# EAGLE design Hiking Log Rev A (EAGLE 9.4.2)
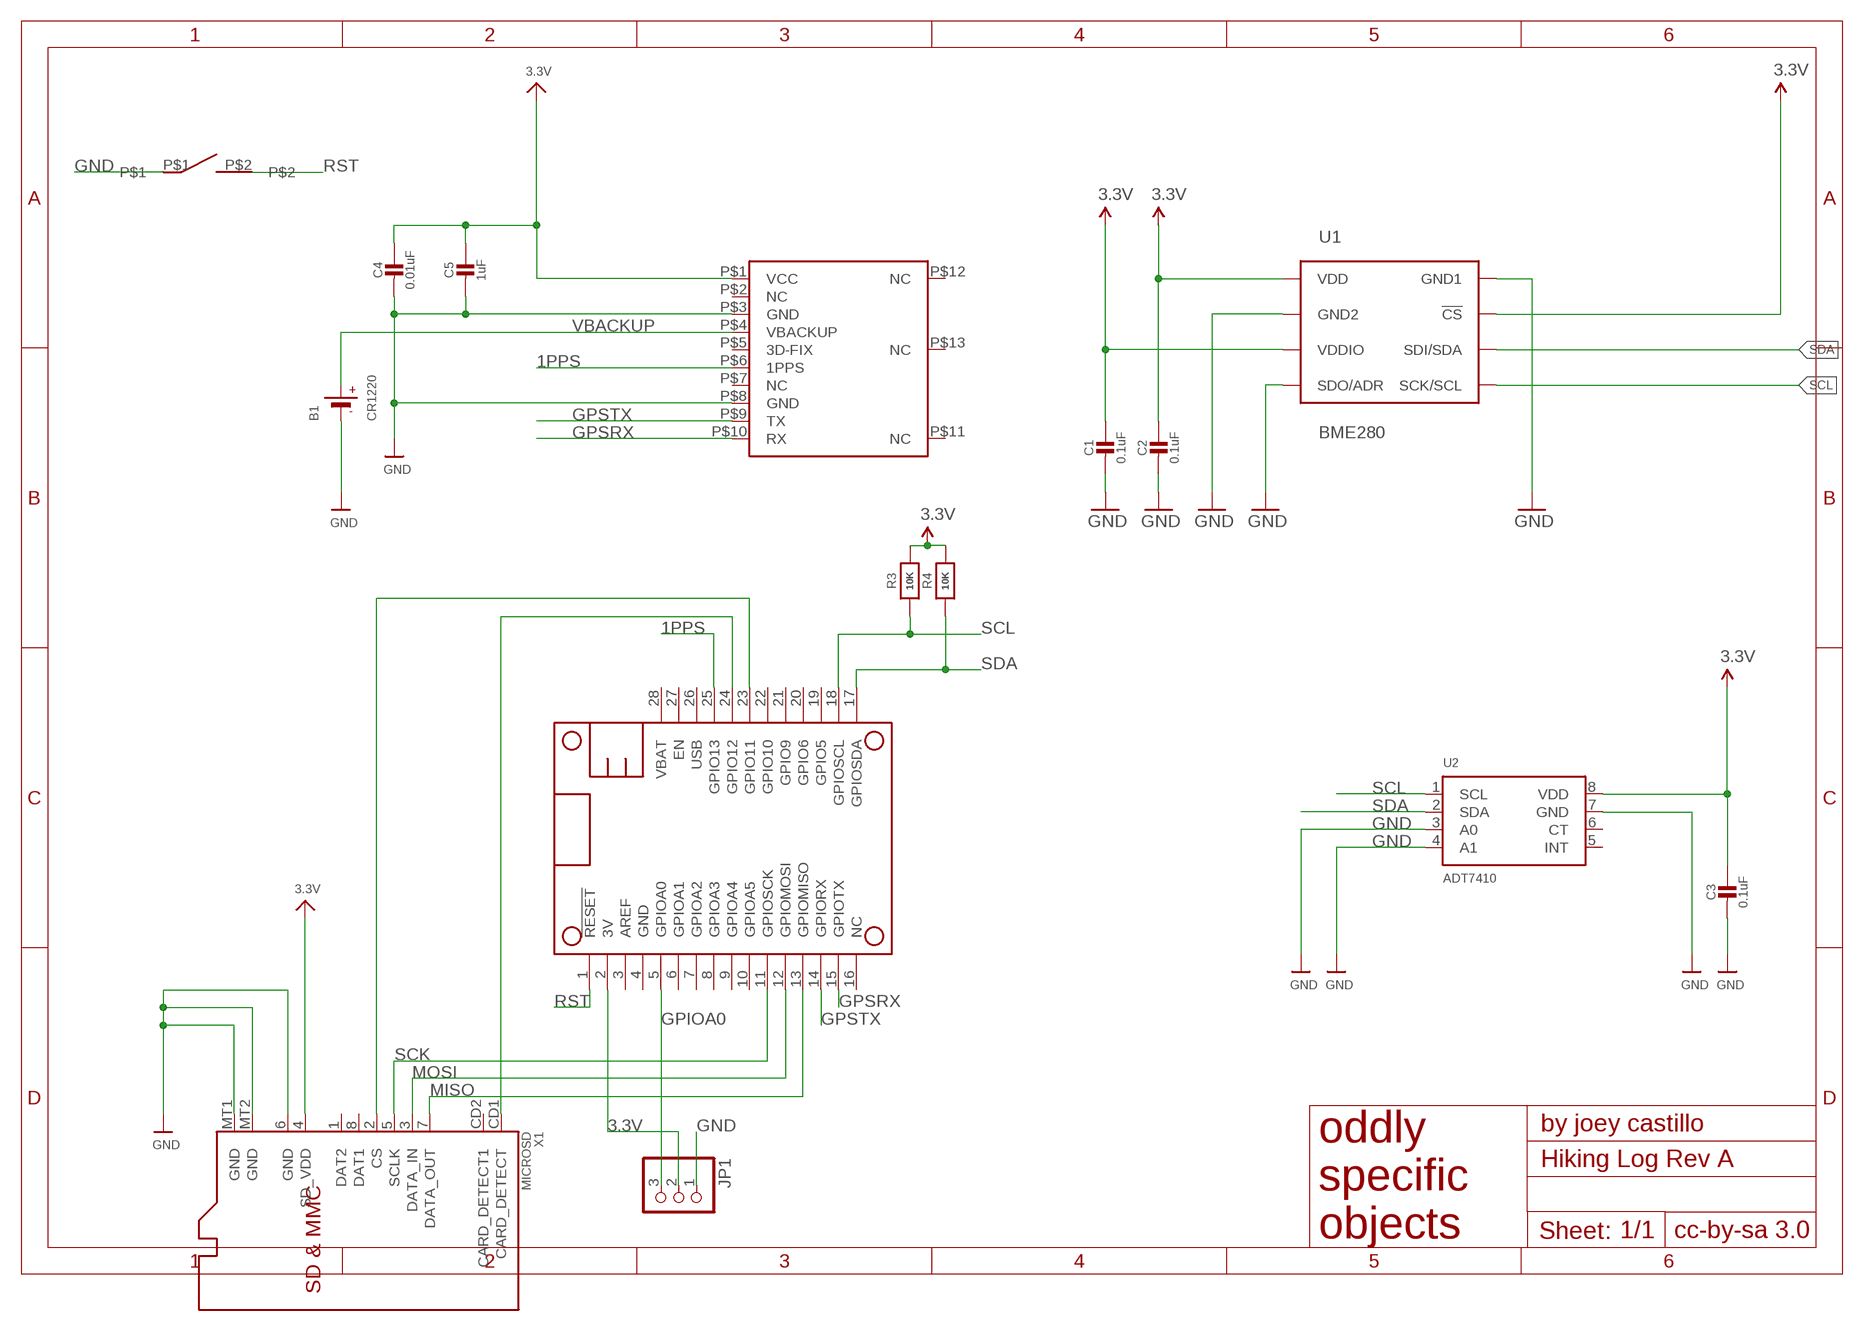
[diagram p0: schematic, sheet 1]

## Parts
B1  CR1220  BATTERYCR1220_2  [CR1220-2]
C1  0.1uF  CAP_CERAMIC_0805MP  [_0805MP]
C2  0.1uF  CAP_CERAMIC_0805MP  [_0805MP]
C3  0.1uF  CAP_CERAMIC_0805MP  [_0805MP]
C4  0.01uF  CAP_CERAMIC_0805MP  [_0805MP]
C5  1uF  CAP_CERAMIC_0805MP  [_0805MP]
JP1  PINHD-1X3CB  [1X03-CLEANBIG]
MS1  FEATHERWING  [FEATHERWING]
R3  10K  RESISTOR_0805MP  [_0805MP]
R4  10K  RESISTOR_0805MP  [_0805MP]
S1  MINISOFTTOUCHBUTTON  [MINISOFTTOUCHBUTTON]
U1  BME280  [BME280_LGA]
U2  ADT7410  TEMP_ADT7410  [SOIC8_150MIL]
U3  GPS_FGPMMOPA6C  [FGPMMOPA6C]
X1  MICROSD  [MICROSD]

## Nets
1PPS: MS1.25(GPIO13) U3.P$6(1PPS)
3.3V: C1.1 C2.1 C3.1 C4.1 C5.1 JP1.2 MS1.2(3V) R3.2 R4.2 U1.P$2(!CS) U1.P$6(VDDIO) U1.P$8(VDD) U2.8(VDD) U3.P$1(VCC) X1.4(SD_VDD)
CD: MS1.24(GPIO12) X1.CD1(CARD_DETECT)
GND: B1.- C1.2 C2.2 C3.2 C4.2 C5.2 JP1.1 S1.P$1 U1.P$1(GND1) U1.P$5(SDO/ADR) U1.P$7(GND2) U2.3(A0) U2.4(A1) U2.7(GND) U3.P$3(GND) U3.P$8(GND) X1.6(GND) X1.MT1(GND) X1.MT2(GND)
GPIOA0: JP1.3 MS1.5(GPIOA0)
GPSRX: MS1.15(GPIOTX) U3.P$10(RX)
GPSTX: MS1.14(GPIORX) U3.P$9(TX)
MISO: MS1.13(GPIOMISO) X1.7(DATA_OUT)
MOSI: MS1.12(GPIOMOSI) X1.3(DATA_IN)
RST: MS1.1(!RESET) S1.P$2
SCK: MS1.11(GPIOSCK) X1.5(SCLK)
SCL: MS1.18(GPIOSCL) R3.1 U1.P$4(SCK/SCL) U2.1(SCL)
SDA: MS1.17(GPIOSDA) R4.1 U1.P$3(SDI/SDA) U2.2(SDA)
SDCS: MS1.23(GPIO11) X1.2(CS)
VBACKUP: B1.+ U3.P$4(VBACKUP)
Unconnected: MS1.3(AREF) MS1.6(GPIOA1) MS1.7(GPIOA2) MS1.8(GPIOA3) MS1.9(GPIOA4) MS1.10(GPIOA5) MS1.16(NC) MS1.19(GPIO5) MS1.20(GPIO6) MS1.21(GPIO9) MS1.22(GPIO10) MS1.26(USB) MS1.27(EN) MS1.28(VBAT) U2.5(INT) U2.6(CT) U3.P$2(NC) U3.P$5(3D-FIX) U3.P$7(NC) U3.P$11(NC) U3.P$12(NC) U3.P$13(NC) X1.1(DAT2) X1.8(DAT1) X1.CD2(CARD_DETECT1)

## Power pins joined to a net without a drawn wire
GND: MS1.4(GND)

## Library data of the parts
B1 = microbuilder:BATTERY: CR1220 SMT - Digikey: 3001K-ND CD2032 BAT-HLD-001 - Digikey: BAT-HLD-001-ND
C1-C5 = microbuilder:CAP_CERAMIC: Ceramic Capacitors For new designs, use the packages preceded by an '_' character since they are more reliable: The following footprints should be used on most boards: _0402 - Standard footprint for regular board layouts _0603 - Standard footprint for regular board layouts _0805 - Standard footprint for regular board layouts _1206 - Standard footprint for regular board layouts For extremely tight-pitch boards where space is at a premium, the following 'micro-pitch' footprints can be used (smaller pads, no silkscreen outline, etc.): _0402MP - Micro-pitch footprint for very dense/compact boards _0603MP - Micro-pitch footprint for very dense/compact boards _0805MP - Micro-pitch footprint for very dense/compact boards _1206MP - Micro-pitch footprint for very dense/compact boards
JP1 = adafruit:PINHD-1X3: PIN HEADER
MS1 = microbuilder:FEATHERWING
R3 R4 = microbuilder:RESISTOR: Resistors For new designs, use the packages preceded by an '_' character since they are more reliable: The following footprints should be used on most boards: _0402 - Standard footprint for regular board layouts _0603 - Standard footprint for regular board layouts _0805 - Standard footprint for regular board layouts _1206 - Standard footprint for regular board layouts For extremely tight-pitch boards where space is at a premium, the following 'micro-pitch' footprints can be used (smaller pads, no silkscreen outline, etc.): _0402MP - Micro-pitch footprint for very dense/compact boards _0603MP - Micro-pitch footprint for very dense/compact boards _0805MP - Micro-pitch footprint for very dense/compact boards _1206MP - Micro-pitch footprint for very dense/compact boards
S1 = My Stuff:MINISOFTTOUCHBUTTON
U1 = BME280ComponentLibrary:BME280; PROD_ID: IC-13090
U2 = microbuilder:TEMP_ADT7410: ADT7410 - 13-bit 0.5°C I2C Temperature Sensor Operating Voltage: 2.7-5.5V Temperature Range: -55°C-150°C Accuracy: 0.5°C from -40°C-105°C Shutdown Current: 2uA (3.3V) Typical Operating Current (1 Sample/s): 46uA (3.3V) Digikey: ADT7410TRZ-ND
U3 = adafruit:GPS_FGPMMOPA6C: FGPMMOPA6C 16x16 GPS Module NMEA Sentences: GGA, GSA, GSV, RMC, VTG
X1 = microbuilder:MICROSD: MicroSD/Transflash Card Holder with SPI pinout 3M: 2908-05WB-MG 4UConnector: 19656 Footprint courtesy: Adafruit Industries

## Board
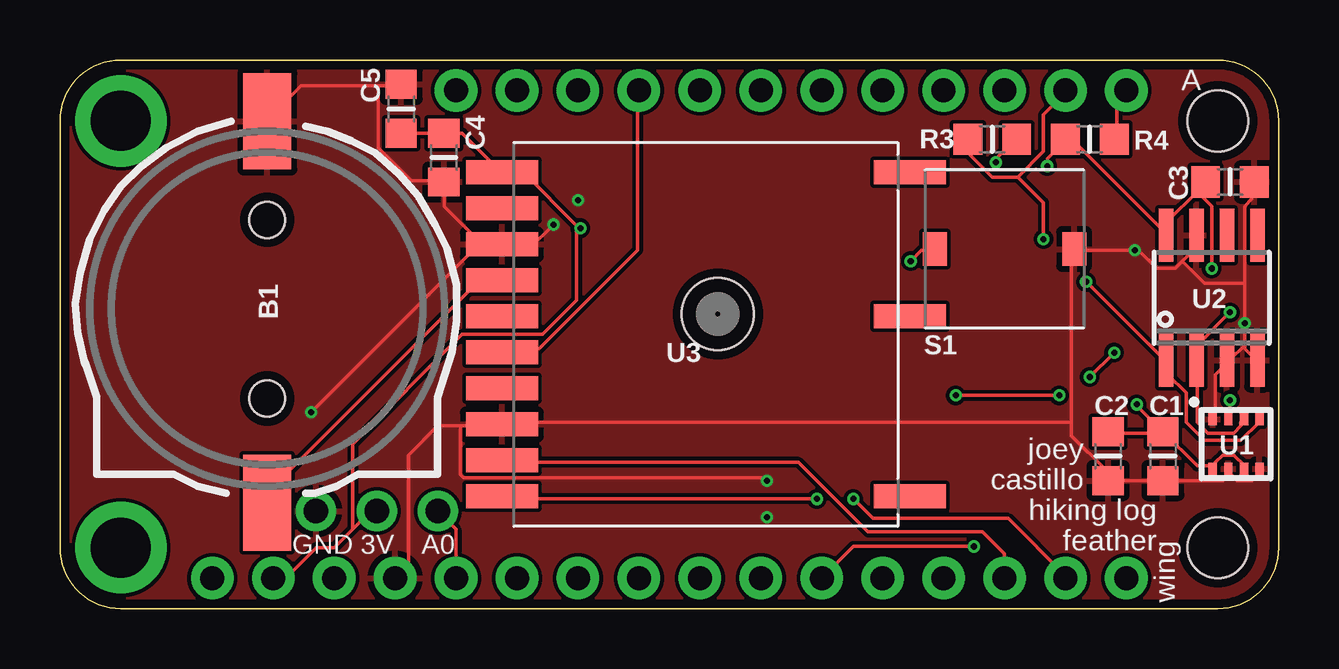
[diagram p1: board, top side]
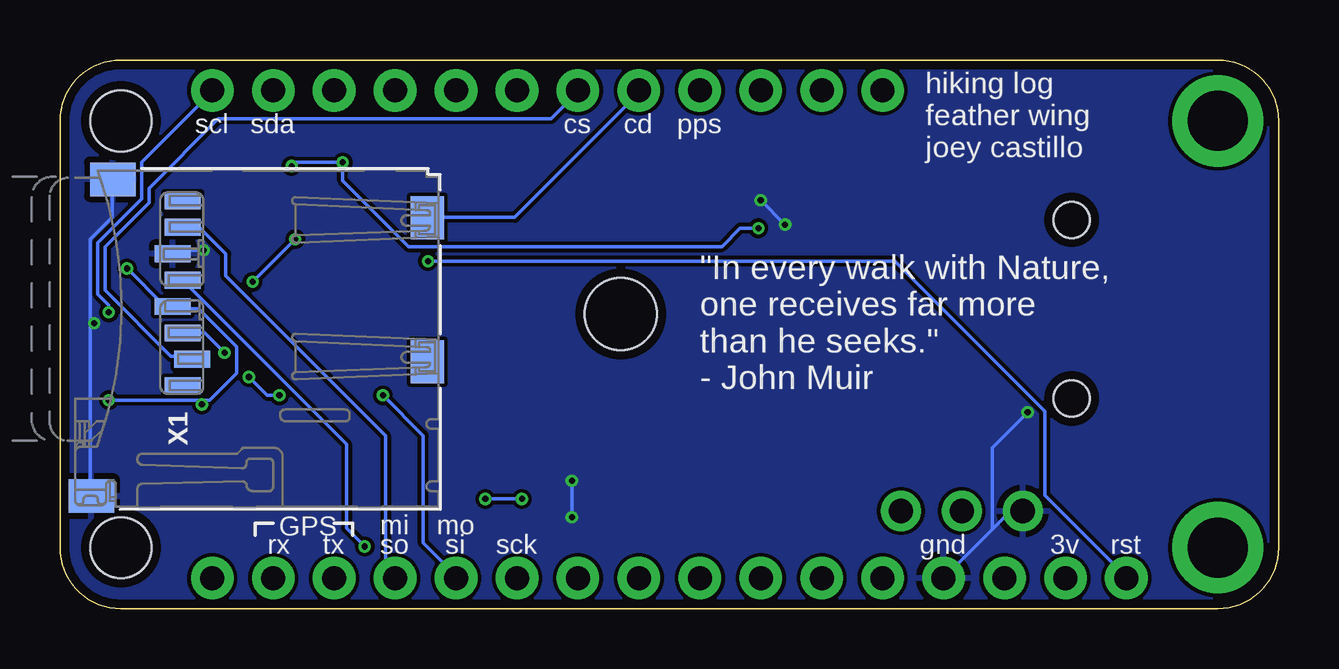
[diagram p2: board, bottom side, seen from below]

Size 50.8 x 22.86 mm. Coordinates in mm from the lower left corner, seen from the top.
Outline: 2.54,22.86 48.26,22.86 arc-90 50.8,20.32 50.8,2.54 arc-90 48.26,0 2.54,0 arc-90 0,2.54 0,20.32 arc-90 2.54,22.86
Copper layers (1*16): Top 0.035559375mm / dielectric 1.6mm / Bottom 0.035559375mm
Design rules "oshpark-2layer": minimum track width 6mil, minimum drill 10mil, track to track 6mil, track to pad 6mil, pad to pad 6mil, via to via 6mil, smd to smd 6mil, copper to edge 15mil, drill to drill 6mil, minimum pad ring 5mil, minimum via ring 5mil, stop-mask expansion 2.5mil, vias tented up to drill 0mil, thermal gap 10mil

### Footprints (pad centres in the part's own frame; a part is rotated, then mirrored left to right if it is on the bottom)
CR1220-2 = smd 4 x 2: + 8.29,0; - -7.6,0 | hole 1.5: 3.95,0; -3.5,0
_0805MP = smd 1.2 x 1.3: 1 -1.016,0; 2 1.016,0
1X03-CLEANBIG = drill 1.016 pad 1.676: 1 -2.54,0; 2 0,0; 3 2.54,0
FEATHERWING = drill 1 pad 1.778: 1 6.35,1.27; 2 8.89,1.27; 3 11.43,1.27; 4 13.97,1.27; 5 16.51,1.27; 6 19.05,1.27; 7 21.59,1.27; 8 24.13,1.27; 9 26.67,1.27; 10 29.21,1.27; 11 31.75,1.27; 12 34.29,1.27; 13 36.83,1.27; 14 39.37,1.27; 15 41.91,1.27; 16 44.45,1.27; 17 44.45,21.59; 18 41.91,21.59; 19 39.37,21.59; 20 36.83,21.59; 21 34.29,21.59; 22 31.75,21.59; 23 29.21,21.59; 24 26.67,21.59; 25 24.13,21.59; 26 21.59,21.59; 27 19.05,21.59; 28 16.51,21.59 | drill 2.5 pad 3.81: P$1 2.54,20.32; P$2 2.54,2.54 | hole 2.54: 48.26,20.32; 48.26,2.54
MINISOFTTOUCHBUTTON = smd 1 x 1.4: P$1 0.4,-3.3; P$2 6.2,-3.3
BME280_LGA = smd 0.5 x 0.35: P$1 1.025,0.975; P$2 1.025,0.325; P$3 1.025,-0.325; P$4 1.025,-0.975; P$5 -1.025,-0.975; P$6 -1.025,-0.325; P$7 -1.025,0.325; P$8 -1.025,0.975
SOIC8_150MIL = smd 0.6 x 2.2: 1 -1.905,-2.6; 2 -0.635,-2.6; 3 0.635,-2.6; 4 1.905,-2.6; 5 1.905,2.6; 6 0.635,2.6; 7 -0.635,2.6; 8 -1.905,2.6
FGPMMOPA6C = smd 3 x 1: P$1 -8.5,6.75; P$2 -8.5,5.25; P$3 -8.5,3.75; P$4 -8.5,2.25; P$5 -8.5,0.75; P$6 -8.5,-0.75; P$7 -8.5,-2.25; P$8 -8.5,-3.75; P$9 -8.5,-5.25; P$10 -8.5,-6.75; P$11 8.5,-6.75; P$12 8.5,0.75; P$13 8.5,6.75 | hole 3: 0.5,0.85
MICROSD = smd 0.7 x 1.5: 1 9,-10.64; 2 7.9,-10.24; 3 6.8,-10.64; 4 5.7,-11.04; 5 4.6,-10.64; 6 3.5,-11.04; 7 2.4,-10.64; 8 1.3,-10.64 | smd 1.8 x 1.4: CD1 2,-0.44; CD2 8,-0.44 | smd 1.4 x 1.9: MT1 0.4,-13.54; MT2 13.6,-14.44

### Placement (x,y rotation side)
B1  8.64,12.7 270 top
C1  45.97,6.35 270 top
C2  43.69,6.35 270 top
C3  48.77,17.78 0 top
C4  16,18.8 270 top
C5  14.22,20.83 90 top
JP1  13.21,4.06 0 top
MS1  0,0 0 top
R3  38.86,19.56 0 top
R4  42.93,19.56 180 top
S1  42.67,11.68 180 top
U1  49.02,6.86 90 top
U2  48.01,12.95 0 top
U3  26.92,11.43 0 top
X1  35.05,18.29 270 bottom

### Tracks (layer width: path | path; a pad name or v marks a point on that pad's centre or on a via)
1PPS
  Top 0.152: U3.P$6 18.44,10.82 19.96,10.82 24.08,14.94 24.08,21.49 MS1.25
3.3V  (via drill 0.25)
  Top 0.152: U1.P$6 49.38,5.94 48.92,6.4 48.46,6.4 48.16,6.1 48.16,5.94 U1.P$8 48.01,5.94 47.4,5.94 C1.1 | C2.1 43.74,7.32 45.87,7.32 C1.1 | v48.77,8.69 48.77,7.92 U1.P$2 | v44.88,8.51 44.88,8.46 C1.1 | v39.01,18.59 39.01,18.75 39.78,19.51 R3.2 | v41.15,18.44 41.15,18.75 41.91,19.51 | 47.4,17.37 46.18,16.15 46.18,15.7 U2.8 46.02,15.7 42.22,19.51 41.91,19.51 | 47.4,17.37 47.7,17.68 C3.1 47.4,17.37 | 41.91,19.51 R4.2 | v48.01,14.17 48.01,16.76 47.4,17.37 | C5.1 C4.1 16.76,19.81 18.29,18.29 U3.P$1 18.44,18.14 19.36,18.14 21.54,15.95 21.54,15.85 | 12.19,3.3 12.19,6.86 16.76,11.43 20.12,11.43 21.54,12.85 21.54,15.85 | 12.19,3.3 11.43,2.54 10.67,2.54 9.4,1.27 MS1.2 | 21.54,15.85 v21.69,15.85 | 12.19,3.3 12.95,4.06 JP1.2
  Bottom 0.152: 44.88,8.69 44.55,8.69 43.43,9.8 43.43,10.92 45.01,12.5 46.02,12.5 X1.4 46.18,12.65 46.48,12.65 v48.01,14.17 | 44.88,8.69 v48.77,8.69 | 44.88,8.69 v44.88,8.51 | v41.15,18.44 41,18.59 v39.01,18.59 39.01,17.83 36.27,15.09 23.22,15.09 22.45,15.85 v21.69,15.85
CD
  Bottom 0.152: X1.CD1 35.36,16.31 31.85,16.31 26.67,21.49 MS1.24
GND  (via drill 0.25)
  Top 0.152: 17.53,15.24 16,16.76 C4.2 16,17.83 14.63,17.83 13.26,19.2 13.26,21.79 | 17.53,15.24 18.29,15.24 U3.P$3 | 13.26,21.79 10.06,21.79 8.69,20.42 B1.- | 13.26,21.79 14.17,21.79 C5.2 | 16.76,7.62 15.75,7.62 14.53,6.4 14.53,1.83 MS1.4 | 16.76,7.62 18.29,7.62 U3.P$8 18.44,7.77 42.16,7.77 | U1.P$1 48.16,7.92 48.16,9.75 48.62,10.21 U2.3 48.77,10.36 49.38,10.97 | 49.38,10.97 49.38,10.82 49.84,10.36 U2.4 | 49.38,10.97 v49.38,11.89 49.38,13.56 | 49.38,13.56 49.38,16.76 49.68,17.07 49.68,17.68 C3.2 | 48.77,5.64 48.77,5.79 U1.P$7 48.77,5.64 | 48.77,5.64 49.07,5.33 49.68,5.33 50.14,5.79 U1.P$5 | 48.77,5.64 48.46,5.33 C1.2 C2.2 43.59,5.33 43.59,5.79 42.16,7.21 42.16,7.77 | 42.67,14.94 v44.81,14.94 44.96,14.94 45.72,14.17 46.48,14.17 46.79,14.48 | 42.37,14.94 42.16,14.94 42.16,7.77 | 42.67,14.94 42.37,14.94 | 46.79,14.48 47.24,14.94 47.24,15.54 U2.7 | 42.37,14.94 S1.P$1 42.67,14.94 | 49.38,13.56 47.7,13.56 46.79,14.48 | 17.53,15.24 v10.46,8.18 | 17.53,15.24 U3.P$3 | U3.P$3 19.36,15.18 19.56,14.99 v20.57,16 | v29.46,5.33 29.35,5.45 16.83,5.45 16.7,5.58 16.7,7.55 16.76,7.62 | 16.76,7.62
  Bottom 0.152: 49.53,11.89 49.53,4.72 X1.MT2 | 49.53,11.89 49.53,15.39 48.62,16.31 48.62,17.83 X1.MT1 | v44.81,14.94 46.02,14.94 X1.6 | v49.38,11.89 49.53,11.89 | MS1.4 11.94,3.3 | v10.46,8.18 11.94,6.71 11.94,3.3 | 11.94,3.3 11.18,4.06 JP1.1 | v21.59,17.02 v20.57,16 | v29.46,5.33 v29.46,3.81
  pour Top: 49.78,23.11 50.8,22.1 51.31,21.59 51.31,1.27 49.78,-0.25 48.01,-0.25 1.52,-0.25 -0.51,1.78 -0.51,21.84 0.76,23.11 1.02,23.11
  pour Bottom: 49.78,23.11 50.8,22.1 51.31,21.59 51.31,1.27 49.78,-0.25 48.01,-0.25 1.52,-0.25 -0.51,1.78 -0.51,21.59 1.02,23.11
GPIOA0
  Top 0.152: JP1.3 16.51,3.3 MS1.5
GPSRX  (via drill 0.25)
  Top 0.152: v31.55,4.57 18.44,4.57 U3.P$10 | v33.07,4.57 33.88,3.76 39.52,3.76 41.91,1.37 MS1.15
  Bottom 0.152: v33.07,4.57 v31.55,4.57
GPSTX
  Top 0.152: U3.P$9 18.44,6.1 30.79,6.1 33.68,3.2 38.46,3.2 39.37,2.29 MS1.14
MISO
  Bottom 0.152: MS1.13 37.24,1.68 37.24,7.21 43.89,13.87 43.89,14.78 44.96,15.85 45.57,15.85 X1.7
MOSI  (via drill 0.25)
  Top 0.152: v37.34,8.89 v41.66,8.89 | v43.94,10.67 v42.93,9.65
  Bottom 0.152: MS1.12 34.29,1.37 35.66,2.74 35.66,7.21 v37.34,8.89 | X1.3 44.76,11.49 v43.94,10.67 | v42.93,9.65 42.16,8.89 v41.66,8.89
RST  (via drill 0.25)
  Top 0.152: v35.46,14.48 35.92,14.94 36.42,14.94 S1.P$2
  Bottom 0.152: v35.46,14.48 16,14.48 9.75,8.23 9.75,4.72 6.4,1.37 MS1.1
SCK  (via drill 0.25)
  Top 0.152: v38.1,2.59 33.07,2.59 MS1.11
  Bottom 0.152: X1.5 38.86,6.86 38.86,3.35 v38.1,2.59
SCL  (via drill 0.25)
  Top 0.152: U1.P$4 49.99,7.77 49.23,7.01 47.7,7.01 46.94,7.77 46.94,8.99 46.18,9.75 46.18,10.21 U2.1 46.02,10.36 v42.77,13.61 | 39.93,17.98 38.86,17.98 37.95,18.9 37.95,19.51 R3.1 | 39.93,17.98 41,19.05 41,20.57 41.91,21.49 MS1.18 | v41,15.39 41,16.92 39.93,17.98
  Bottom 0.152: v41,15.39 v42.77,13.61
SDA  (via drill 0.25)
  Top 0.152: U1.P$3 49.23,7.77 49.23,7.62 48.92,7.32 47.85,7.32 47.4,7.77 47.4,10.21 U2.2 47.4,10.36 47.4,10.97 v48.77,12.34 | MS1.17 44.04,21.18 44.04,19.66 R4.1
  Bottom 0.152: v48.77,12.34 48.77,12.65 49.23,13.11 49.23,15.24 47.4,17.07 47.4,18.59 44.5,21.49 MS1.17
SDCS
  Bottom 0.152: X1.2 45.41,10.52 46.18,10.52 48.92,13.26 48.92,15.09 47.09,16.92 47.09,17.53 44.2,20.42 30.33,20.42 29.26,21.49 MS1.23
VBACKUP
  Top 0.152: U3.P$4 18.29,13.56 17.37,13.56 8.69,4.88 8.69,4.42 B1.+

### Text on the board
tPlace: A | joey | castillo | hiking log | feather | GND | 3V | A0 | wing
bPlace: pps | cd | cs | sda | scl | hiking log / feather wing / joey castillo | "In every walk with Nature, / one receives far more / than he seeks." / - John Muir | GPS | rst | 3v | gnd | sck | mo / si | mi / so | tx | rx